# Altium schematic sheet MCU.SchDoc
size A3; SheetNumber: 2; SheetTotal: 3; SPICEModelCacheLCPKTQCQ: <root> / <DocumentId>LCPKTQCQ</DocumentId> / <CacheFrame Number="0"> / <Model Name="hdsp_303a" Kind="CKT"> / <Text>* / * Diode Model Produced by Altium Ltd / * Date:  10-Mar-2004 / * / * Manufacturer: Agilent / * Component Name: HDSP-303A / * / * Parameters derived from information available in data sheet. / * / *                 anode-G / *                 |  anode-F / *                 |  |  comon-cathode / *                 |  |  |  anode-E / *                 |  |  |  |  anode-D / *                 |  |  |  |  |  anode-DP / *                 |  |  |  |  |  |  anode-C / *                 |  |  |  |  |  |  |  comon-cathode / *                 |  |  |  |  |  |  |  |  anode-B / *                 |  |  |  |  |  |  |  |  |  anode-A / *                 |  |  |  |  |  |  |  |  |  | / .SUBCKT HDSP_303A 1  2  3  4  5  6  7  8  9  10 / DA1  10  3  dHDSP_303A / DB1   9  3  dHDSP_303A / DC1   7  3  dHDSP_303A / DD1   5  3  dHDSP_303A / DE1   4  3  dHDSP_303A / DF1   2  3  dHDSP_303A / DG1   1  3  dHDSP_303A / DDP1  6  3  dHDSP_303A / DA2  10  8  dHDSP_303A / DB2   9  8  dHDSP_303A / DC2   7  8  dHDSP_303A / DD2   5  8  dHDSP_303A / DE2   4  8  dHDSP_303A / DF2   2  8  dHDSP_303A / DG2   1  8  dHDSP_303A / DDP2  6  8  dHDSP_303A / .MODEL dHDSP_303A D / + ( / +    IS = 4.59961571E-15 / +     N = 2.40621673 / +    RS = 1.90931135 / +    BV = 4.5 / +   IBV = 100u / + ) / .ENDS HDSP_303A</Text> / </Model> / </CacheFrame> / </root>
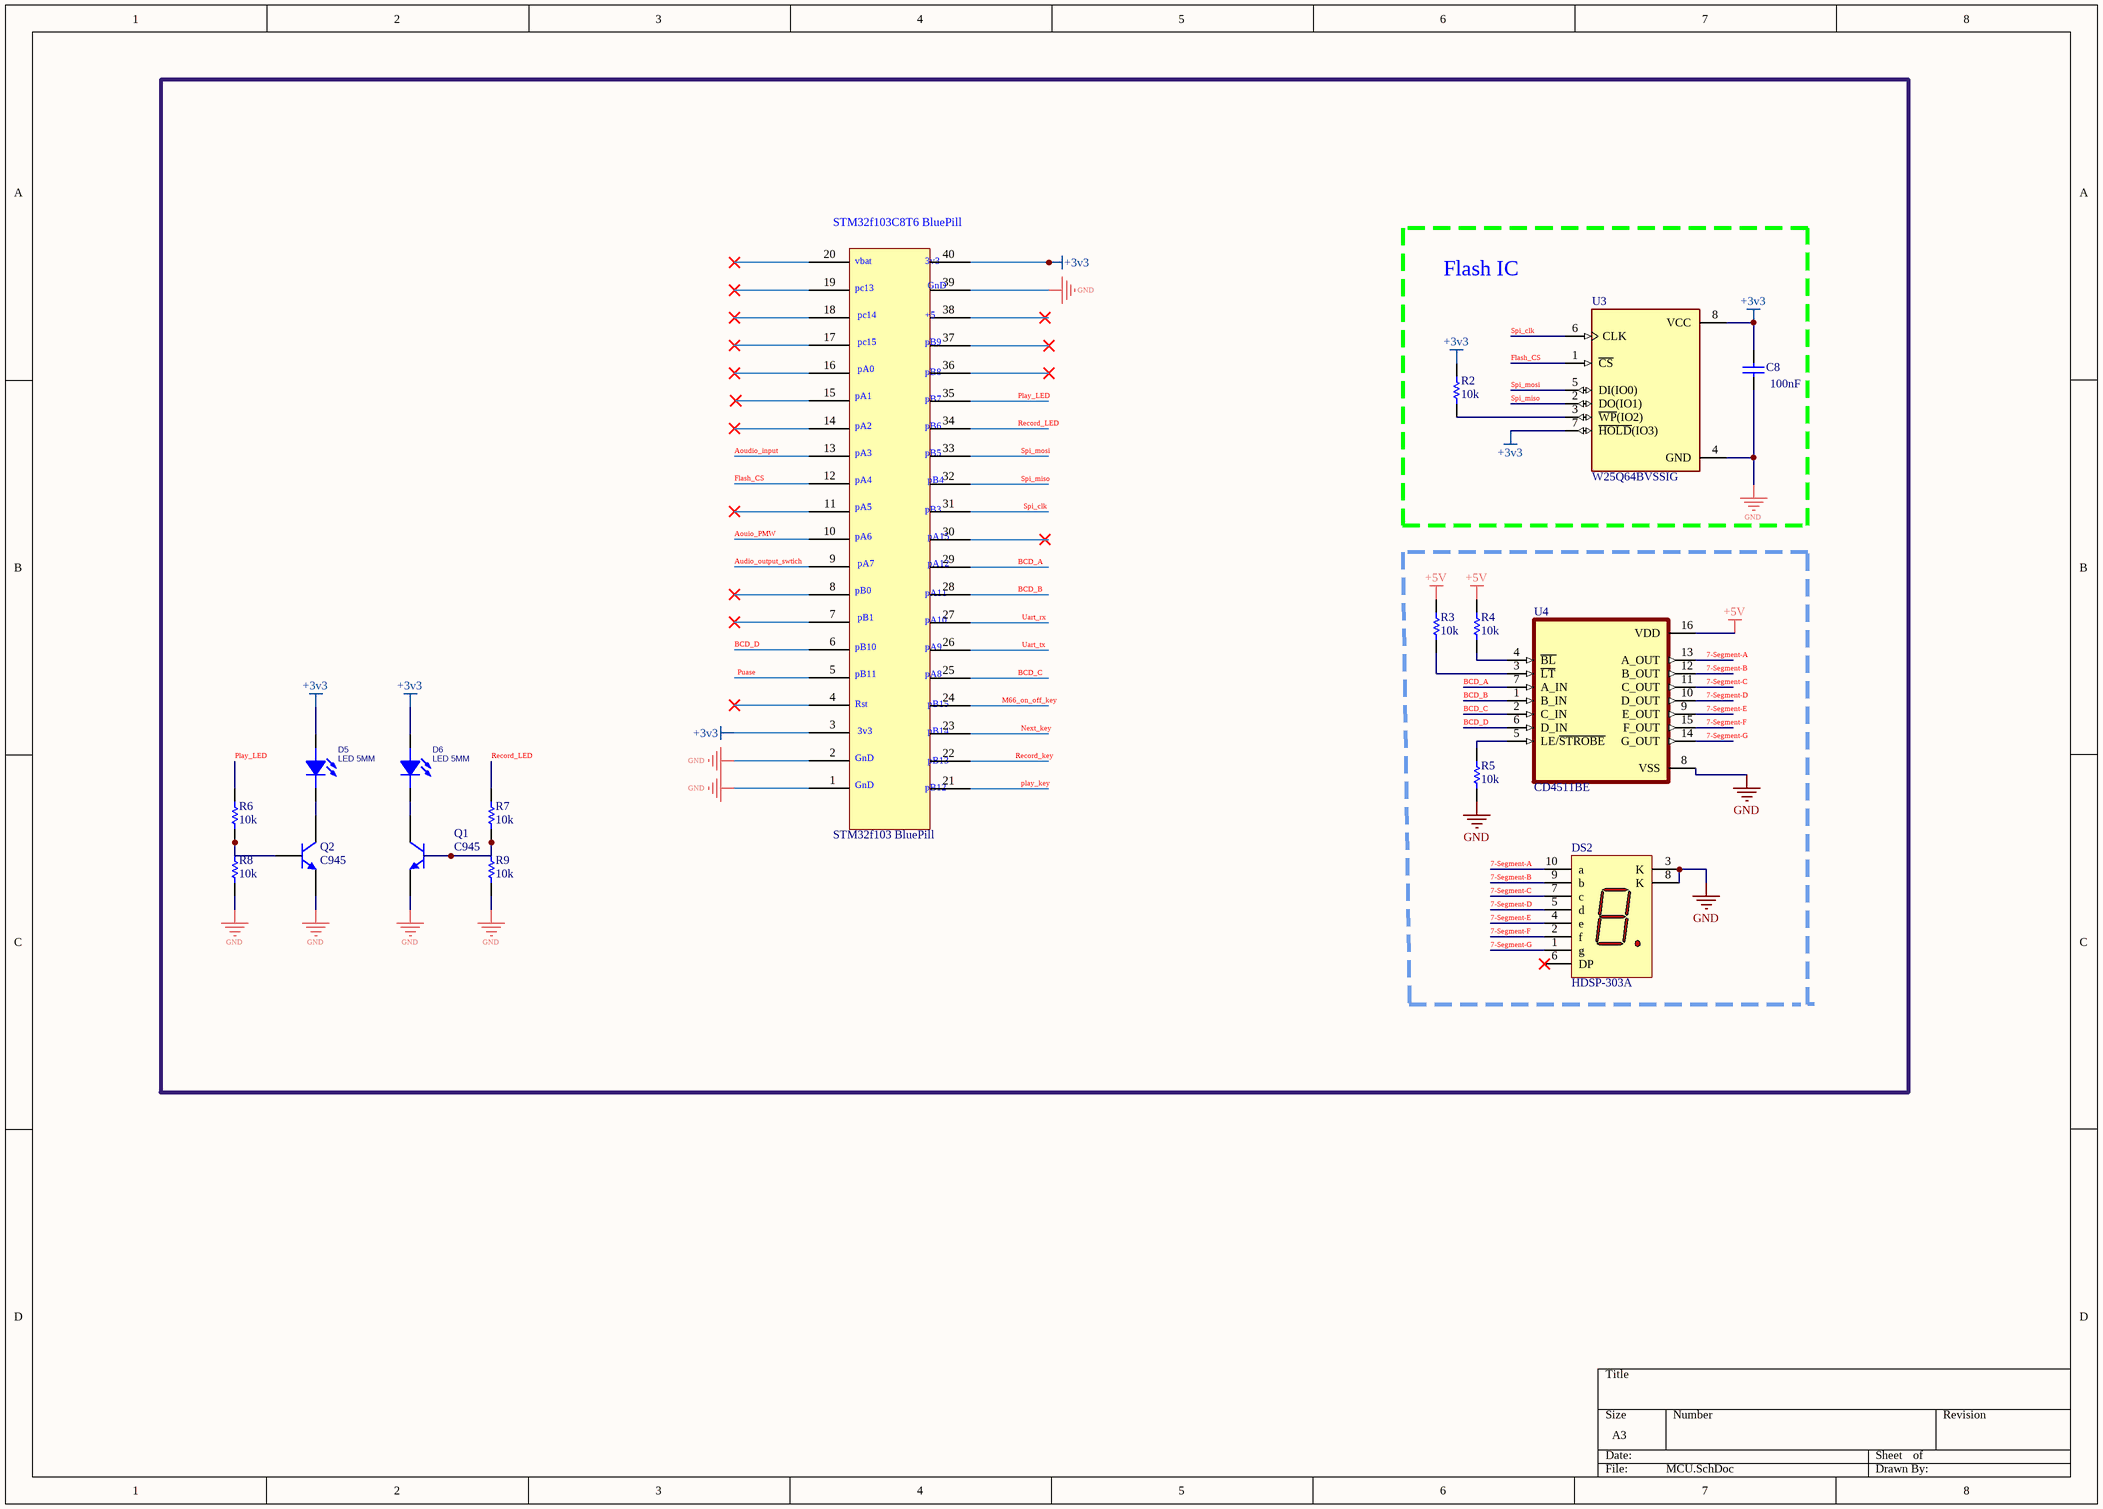
[diagram p0: MCU.SchDoc]

## Parts
C8  value 100nF  [CAP805]
D5  LED 5MM  [LED5MM_GRN]
D6  LED 5MM  [LED5MM_RED]
DS2  HDSP-303A  [F-10]
Q1  C945  [C945]
Q2  C945  [C945]
R2  10k  [RES0805]
R3  10k  [RES0805]
R4  10k  [RES0805]
R5  10k  [RES0805]
R6  10k  [RES0805]
R7  10k  [RES0805]
R8  10k  [RES0805]
R9  10k  [RES0805]
STM1  STM32f103 BluePill  [BluePill]
U3  W25Q64BVSSIG  [SOIC127P790X216-8N]
U4  CD4511BE  [DIP794W45P254L1969H508Q16]

## Blocks framed on the sheet
Flash IC: C8 R2 U3

## Nets
+3v3: C8.2 D5.1(ANODE) D6.1(ANODE) R2.2 STM1.3 STM1.40 U3.7(~{HOLD}(IO3)) U3.8(VCC)
+5V: R3.1 R4.1 U4.16(VDD)
GND: C8.1 DS2.3(K) DS2.8(K) Q1.1(E) Q2.1(E) R5.1 R8.1 R9.1 STM1.1 STM1.2 STM1.39 U3.4(GND) U4.8(VSS)
7-Segment-A: DS2.10(a) U4.13(A_OUT)
7-Segment-B: DS2.9(b) U4.12(B_OUT)
7-Segment-C: DS2.7(c) U4.11(C_OUT)
7-Segment-D: DS2.5(d) U4.10(D_OUT)
7-Segment-E: DS2.4(e) U4.9(E_OUT)
7-Segment-F: DS2.2(f) U4.15(F_OUT)
7-Segment-G: DS2.1(g) U4.14(G_OUT)
Aoudio_input: STM1.13
Aouio_PMW: STM1.10
Audio_output_swtich: STM1.9
BCD_A: STM1.29 U4.7(A_IN)
BCD_B: STM1.28 U4.1(B_IN)
BCD_C: STM1.25 U4.2(C_IN)
BCD_D: STM1.6 U4.6(D_IN)
Flash_CS: STM1.12 U3.1(~{CS})
M66_on_off_key: STM1.24
Next_key: STM1.23
play_key: STM1.21
Play_LED: R6.2 STM1.35
Puase: STM1.5
Record_key: STM1.22
Record_LED: R7.2 STM1.34
Spi_clk: STM1.31 U3.6(CLK)
Spi_miso: STM1.32 U3.2(DO(IO1))
Spi_mosi: STM1.33 U3.5(DI(IO0))
Uart_rx: STM1.27
Uart_tx: STM1.26
NetD5_2: D5.2(CATHODE) Q2.2(C)
NetD6_2: D6.2(CATHODE) Q1.2(C)
NetQ1_3: Q1.3(B) R7.1 R9.2
NetQ2_3: Q2.3(B) R6.1 R8.2
NetR2_1: R2.1 U3.3(~{WP}(IO2))
NetR3_2: R3.2 U4.3(~{LT})
NetR4_2: R4.2 U4.4(~{BL})
NetR5_2: R5.2 U4.5(LE/~{STROBE})

Not connected (* = marked no-connect by the designer): DS2 6(DP)*; STM1 4* 7* 8* 11* 14* 15* 16* 17* 18* 19* 20* 30* 36* 37* 38*

## Notes on the sheet
- (in symbol STM32f103 BluePill) STM32f103C8T6 BluePill; vbat; 3v3; GnD; pc13; pc14; +5; pc15; pB9; pA0; pB8; pA1; pB7; pA2; pB6; pA3; pB5; pA4; pB4; pA5; pB3; pA6; pA15; pA7; pA12; pB0; pA11; pB1; pA10; pB10; pA9; pB11; pA8; Rst; pB15; pB14; pB13; pB12

## Library data of the parts
C8 = Cap: Capacitor; Published: 8-Jun-2000; LatestRevisionDate: 17-Jul-2002; LatestRevisionNote: Re-released for DXP Platform.; Publisher: Altium Limited
D5 D6 = LED 5MM: Light Emitting Diode; Designer: Abbas Basereh; Data: 16-12-2016; Link: *; Part.No: *
DS2 = HDSP-303A: 10 mm Slim Font, AlGaAs 7-Segment Display: CC, RH DP; LuminousIntensity: 320 ucd (Minimum).; LED_Colour: AlGaAs Red; Published: 26-May-2004; LatestRevisionDate: 11-Oct-2004; LatestRevisionNote: Display outline superimposed on PCB Footprint.; DatasheetDocument: 1-Oct-2001; PackageDocument: 17-Jan-2002; PackageReference: F-10; Publisher: Altium Limited; ComponentLink1Description: Manufacturer Link; ComponentLink1URL: http://www.agilent.com/; ComponentLink2Description: Datasheet; ComponentLink2URL: http://cp.literature.agilent.com/litweb/pdf/5988-4352EN.pdf
Q1 Q2 = C945 2: NPN Transistor; Designer: Saeid Jorablo; Company: IPA CO; Last Update Time: 2008/08/04; Value: C945
R2-R9 = RES 0805 0.125W_1: RES 0805; Designer: Abbas Basereh; Desc.: RES SMD 0805; Data: 16-12-2016
U3 = W25Q64BVSSIG: IC FLASH 64MBIT 80MHZ 8SOIC; MF: {'manufacturer': u'Winbond Electronics'}; Package: None; Price: None; Value: *; MP: W25Q64BVSSIG; Availability: Unavailable
U4 = CD4511BE: Price: None; MP: CD4511BE; Availability: Unavailable; Value: *; Package: None